# EAGLE design Mini Power Supply (EAGLE 6.4)
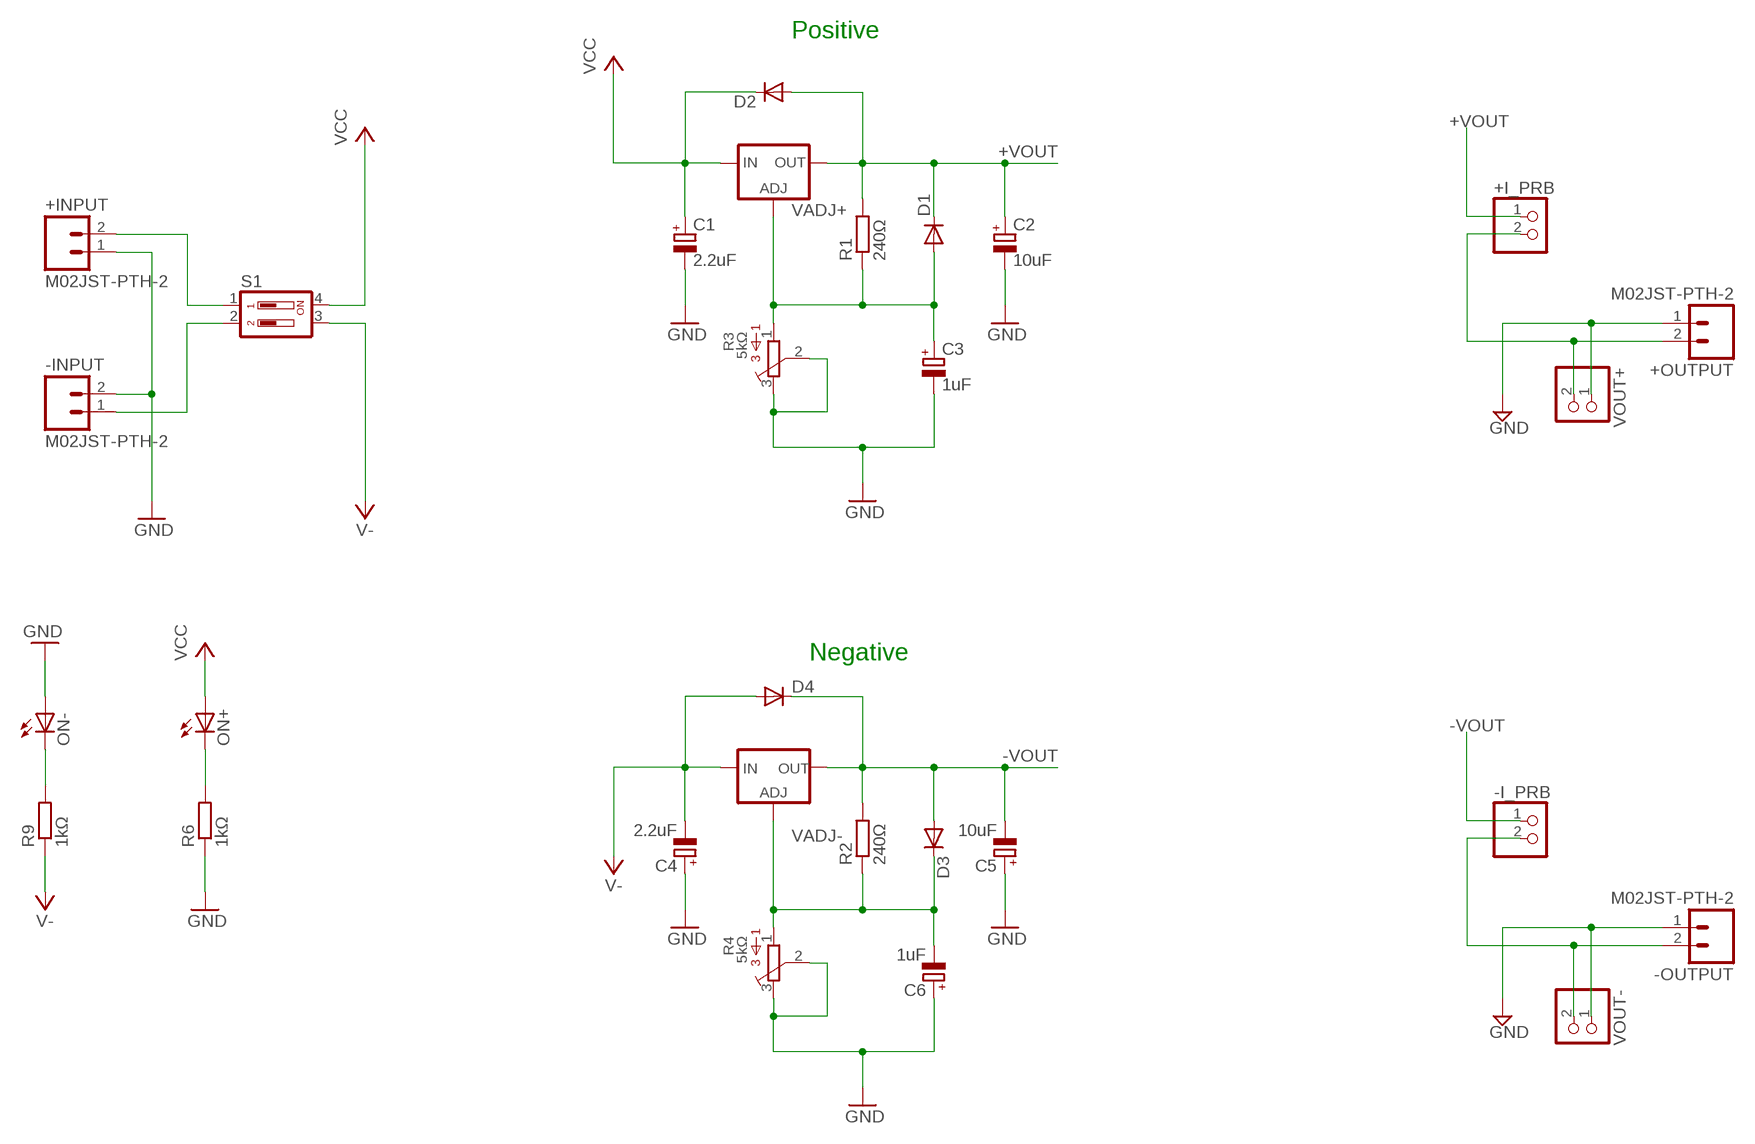
[diagram p0: schematic, sheet 1]

## Parts
+I_PRB  PINHD-1X2  [1X02]
+INPUT  M02JST-PTH-2  [JST-2-PTH]
+OUTPUT  M02JST-PTH-2  [JST-2-PTH]
-I_PRB  PINHD-1X2  [1X02]
-INPUT  M02JST-PTH-2  [JST-2-PTH]
-OUTPUT  M02JST-PTH-2  [JST-2-PTH]
C1  2.2uF  CPOL-EUE2.5-6  [E2,5-6]
C2  10uF  CPOL-EUE2.5-6  [E2,5-6]
C3  1uF  CPOL-EUE2.5-6  [E2,5-6]
C4  2.2uF  CPOL-EUE2.5-6  [E2,5-6]
C5  10uF  CPOL-EUE2.5-6  [E2,5-6]
C6  1uF  CPOL-EUE2.5-6  [E2,5-6]
D1  1N4148DO35-7  [DO35-7]
D2  1N4148DO35-7  [DO35-7]
D3  1N4148DO35-7  [DO35-7]
D4  1N4148DO35-7  [DO35-7]
ON+  LEDSQR2X5  [LED2X5]
ON-  LEDSQR2X5  [LED2X5]
R1  240Ω  R-EU_0207/10  [0207/10]
R2  240Ω  R-EU_0207/10  [0207/10]
R3  5kΩ  3386-U  [3386U]
R4  5kΩ  3386-U  [3386U]
R6  1kΩ  R-EU_0207/10  [0207/10]
R9  1kΩ  R-EU_0207/10  [0207/10]
S1  DIP02YL  [DIP02YL]
VADJ+  LM317L  [317L]
VADJ-  LM337L  [337L]
VOUT+  PINHD-1X2  [1X02]
VOUT-  PINHD-1X2  [1X02]

## Nets
+VOUT: +I_PRB.1 C2.+ D1.C D2.A R1.2 VADJ+.2(OUT)
-VOUT: -I_PRB.1 C5.- D3.A D4.C R2.2 VADJ-.OUT
GND: +INPUT.1 +OUTPUT.1 -INPUT.2 -OUTPUT.1 C1.- C2.- C3.- C4.+ C5.+ C6.+ ON-.A R3.2 R3.3 R4.2 R4.3 R6.1 VOUT+.1 VOUT-.1
N$1: C6.- D3.C R2.1 R4.1 VADJ-.ADJ
N$2: +INPUT.2 S1.1
N$3: C3.+ D1.A R1.1 R3.1 VADJ+.1(ADJ)
N$4: ON-.K(C) R9.2
N$5: -INPUT.1 S1.2
N$6: ON+.K(C) R6.2
N$7: +I_PRB.2 +OUTPUT.2 VOUT+.2
N$10: -I_PRB.2 -OUTPUT.2 VOUT-.2
V-: C4.- D4.A R9.1 S1.3 VADJ-.IN
VCC: C1.+ D2.C ON+.A S1.4 VADJ+.3(IN)

## Notes on the sheet
- Positive
- Negative

## Library data of the parts
+I_PRB -I_PRB VOUT+ VOUT- = pinhead:PINHD-1X2: PIN HEADER
+INPUT +OUTPUT -INPUT -OUTPUT = SparkFun-Connectors:M02: Standard 2-pin 0.1" header. Use with - straight break away headers ( PRT-00116) - right angle break away headers (PRT-00553) - swiss pins (PRT-00743) - machine pins (PRT-00117) - female headers (PRT-00115) Molex polarized connector foot print use with: PRT-08233 with associated crimp pins and housings. 2.54_SCREWTERM for use with PRT-10571. 3.5mm Screw Terminal footprints for PRT-08084 5mm Screw Terminal footprints for use with PRT-08433
C1-C6 = rcl:CPOL-EU: POLARIZED CAPACITOR, European symbol
D1-D4 = diode:1N4148: DIODE high speed (Philips)
ON+ ON- = led:LED: LED OSRAM: - CHIPLED LG R971, LG N971, LY N971, LG Q971, LY Q971, LO R971, LY R971 LH N974, LH R974 LS Q976, LO Q976, LY Q976 LO Q996 - Hyper CHIPLED LW Q18S LB Q993, LB Q99A, LB R99A - SideLED LS A670, LO A670, LY A670, LG A670, LP A670 LB A673, LV A673, LT A673, LW A673 LH A674 LY A675 LS A676, LA A676, LO A676, LY A676, LW A676 LS A679, LY A679, LG A679 - Hyper Micro SIDELED® LS Y876, LA Y876, LO Y876, LY Y876 LT Y87S - SmartLED LW L88C, LW L88S LB L89C, LB L89S, LG L890 LS L89K, LO L89K, LY L89K LS L896, LA L896, LO L896, LY L896 - TOPLED LS T670, LO T670, LY T670, LG T670, LP T670 LSG T670, LSP T670, LSY T670, LOP T670, LYG T670 LG T671, LOG T671, LSG T671 LB T673, LV T673, LT T673, LW T673 LH T674 LS T676, LA T676, LO T676, LY T676, LB T676, LH T676, LSB T676, LW T676 LB T67C, LV T67C, LT T67C, LS T67K, LO T67K, LY T67K, LW E67C LS E67B, LA E67B, LO E67B, LY E67B, LB E67C, LV E67C, LT E67C LW T67C LS T679, LY T679, LG T679 LS T770, LO T770, LY T770, LG T770, LP T770 LB T773, LV T773, LT T773, LW T773 LH T774 LS E675, LA E675, LY E675, LS T675 LS T776, LA T776, LO T776, LY T776, LB T776 LHGB T686 LT T68C, LB T68C - Hyper Mini TOPLED® LB M676 - Mini TOPLED Santana® LG M470 LS M47K, LO M47K, LY M47K Source: http://www.osram.convergy.de LUXEON: - LUMILED® LXK2-PW12-R00, LXK2-PW12-S00, LXK2-PW14-U00, LXK2-PW14-V00 LXK2-PM12-R00, LXK2-PM12-S00, LXK2-PM14-U00 LXK2-PE12-Q00, LXK2-PE12-R00, LXK2-PE12-S00, LXK2-PE14-T00, LXK2-PE14-U00 LXK2-PB12-K00, LXK2-PB12-L00, LXK2-PB12-M00, LXK2-PB14-N00, LXK2-PB14-P00, LXK2-PB14-Q00 LXK2-PR12-L00, LXK2-PR12-M00, LXK2-PR14-Q00, LXK2-PR14-R00 LXK2-PD12-Q00, LXK2-PD12-R00, LXK2-PD12-S00 LXK2-PH12-R00, LXK2-PH12-S00 LXK2-PL12-P00, LXK2-PL12-Q00, LXK2-PL12-R00 Source: www.luxeon.com KINGBRIGHT: KA-3528ASYC Source: www.kingbright.com
R1 R2 R6 R9 = resistor:R-EU_: RESISTOR, European symbol
R3 R4 = bourns:3386-: 3386 Series 3/8" Square Trimmer
S1 = switch-dil:DIP02YL: DIL/CODE SWITCH; OC_FARNELL: unknown; OC_NEWARK: unknown
VADJ+ = v-reg:LM317L: VOLTAGE REGULATOR
VADJ- = v-reg:LM337L: VOLTAGE REGULATOR

## Board
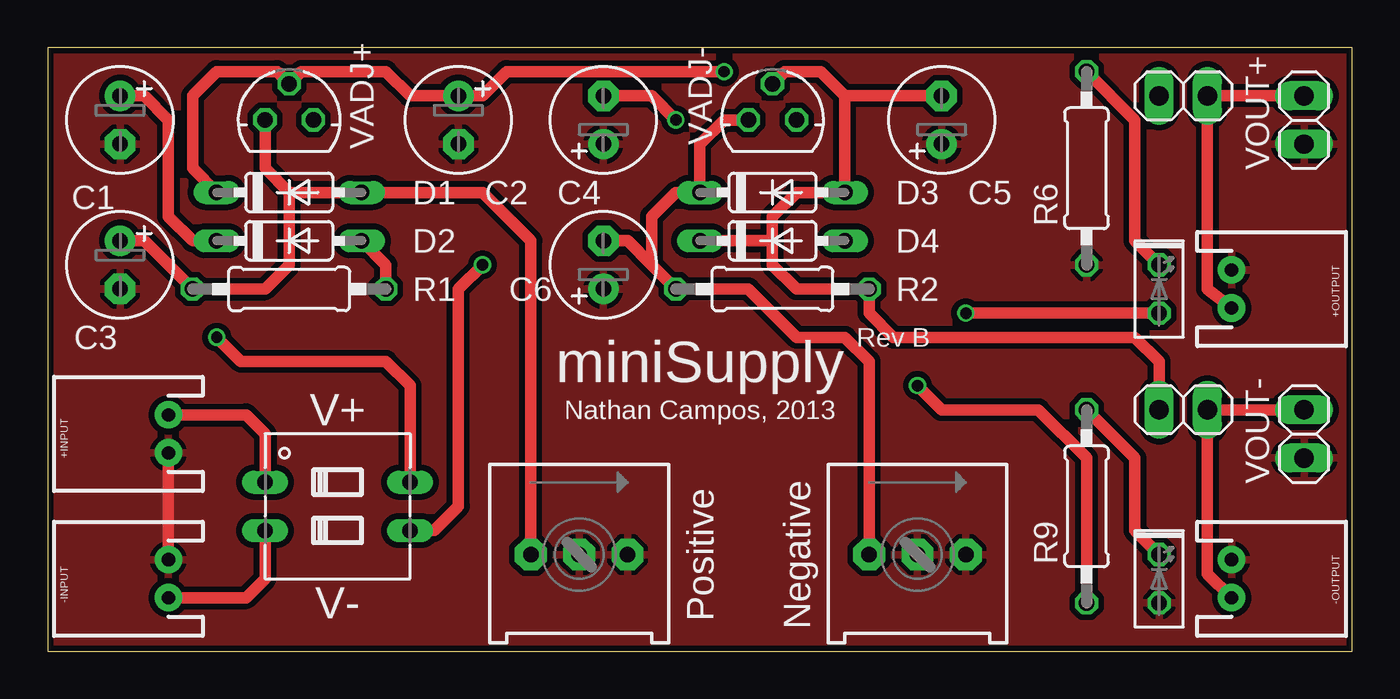
[diagram p1: board, top side]
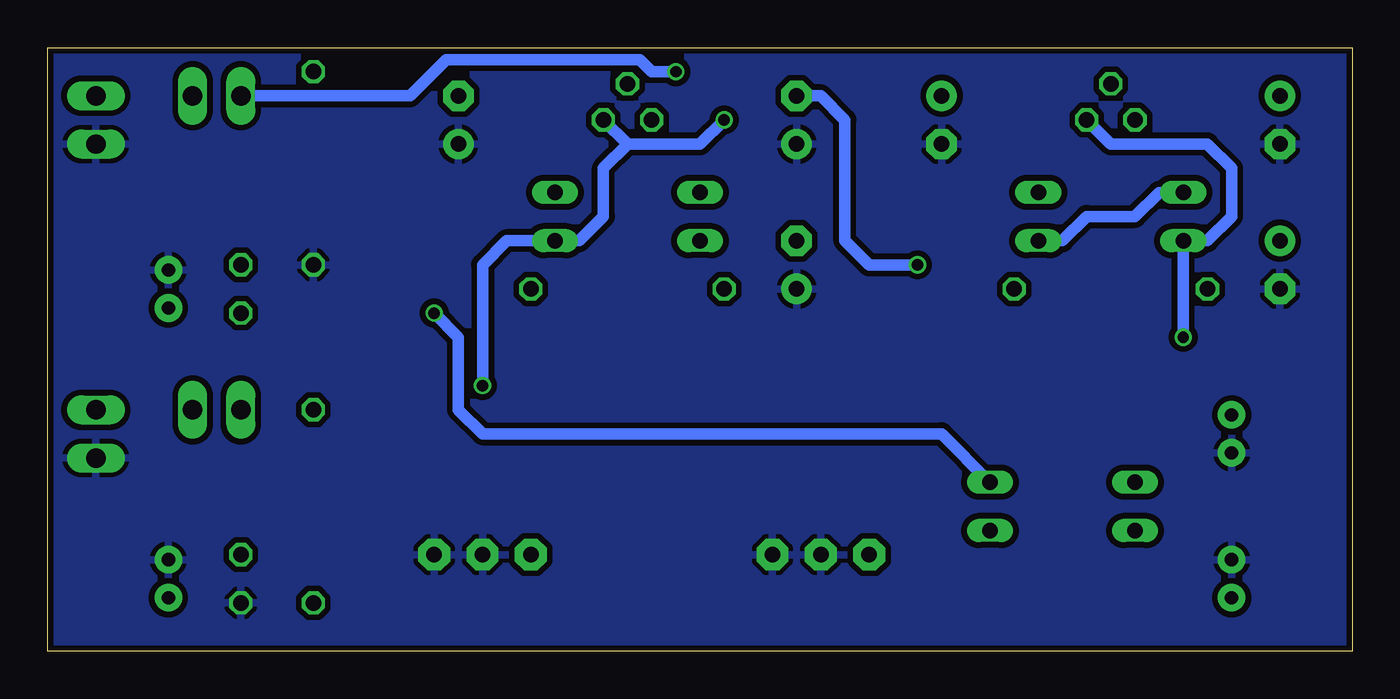
[diagram p2: board, bottom side, seen from below]

Size 68.58 x 31.75 mm. Coordinates in mm from the lower left corner, seen from the top.
Outline: 0,0 68.58,0 68.58,31.75 0,31.75 0,0
Copper layers (1*2*15*16): Top 0.035mm / dielectric 0.2mm / Route2 0.0175mm / dielectric 1.1mm / Route15 0.0175mm / dielectric 0.2mm / Bottom 0.035mm
Design rules "SeeedStudio_DRU_no_angle_20130527": minimum track width 6mil, minimum drill 12mil, track to track 6mil, track to pad 6mil, pad to pad 6mil, via to via 6mil, smd to smd 0mil, copper to edge 10mil, drill to drill 10mil, minimum pad ring 6mil, minimum via ring 6mil, stop-mask expansion 2mil, vias tented up to drill 25mil, thermal gap 10mil

### Footprints (pad centres in the part's own frame; a part is rotated, then mirrored left to right if it is on the bottom)
1X02 = drill 1.016 long: 1 -1.27,0; 2 1.27,0
JST-2-PTH = drill 0.7 pad 1.448: 1 -1,0; 2 1,0
E2,5-6 = drill 0.813 pad 1.6: + -1.27,0 | drill 0.813 pad 1.6 octagon: - 1.27,0
DO35-7 = drill 0.813 long: A 3.81,0; C -3.81,0
LED2X5 = drill 0.813 octagon: A -1.27,0; K 1.27,0
0207/10 = drill 0.813 octagon: 1 -5.08,0; 2 5.08,0
3386U = drill 0.813 pad 1.676 octagon: 1 -2.54,0; 2 0,0; 3 2.54,0
DIP02YL = drill 0.813 long: 1 -1.27,-3.81; 2 1.27,-3.81; 3 1.27,3.81; 4 -1.27,3.81
317L = drill 0.813 octagon: 1 -1.27,0; 2 0,1.905; 3 1.27,0
337L = drill 0.813 octagon: ADJ -1.27,0; IN 1.27,0; OUT 0,1.905

### Placement (x,y rotation side)
+I_PRB  59.69,29.21 0 top
+INPUT  6.35,11.43 90 top
+OUTPUT  62.23,19.05 270 top
-I_PRB  59.69,12.7 0 top
-INPUT  6.35,3.81 90 top
-OUTPUT  62.23,3.81 270 top
C1  3.81,27.94 270 top
C2  21.59,27.94 270 top
C3  3.81,20.32 270 top
C4  29.21,27.94 90 top
C5  46.99,27.94 90 top
C6  29.21,20.32 90 top
D1  12.7,24.13 0 top
D2  12.7,21.59 0 top
D3  38.1,24.13 0 top
D4  38.1,21.59 0 top
ON+  58.42,19.05 90 top
ON-  58.42,3.81 90 top
R1  12.7,19.05 0 top
R2  38.1,19.05 0 top
R3  27.94,5.08 0 top
R4  45.72,5.08 0 top
R6  54.61,25.4 90 top
R9  54.61,7.62 90 top
S1  15.24,7.62 270 top
VADJ+  12.7,27.94 0 top
VADJ-  38.1,27.94 0 top
VOUT+  66.04,27.94 90 top
VOUT-  66.04,11.43 90 top

### Tracks (layer width: path | path; a pad name or v marks a point on that pad's centre or on a via)
+VOUT  (via drill 0.6)
  Top 0.61: D1.C 7.62,25.4 7.62,29.21 8.89,30.48 12.06,30.48 VADJ+.2 13.34,30.48 17.78,30.48 19.05,29.21 C2.+ 22.86,29.21 24.13,30.48 v35.56,30.48 | R1.2 17.78,20.32 D2.A
  Bottom 0.61: D2.A 15.24,21.59 13.97,22.86 11.43,22.86 10.16,24.13 D1.C | +I_PRB.1 49.53,29.21 47.62,31.11 37.47,31.11 36.83,30.48 v35.56,30.48
-VOUT
  Top 0.61: 41.91,29.21 D3.A 39.37,24.13 38.1,22.86 38.1,21.59 | 41.91,29.21 40.64,30.48 38.73,30.48 VADJ-.OUT | 38.1,21.59 38.1,20.32 39.37,19.05 R2.2 43.18,17.78 44.45,16.51 57.15,16.51 58.42,15.24 -I_PRB.1 | D4.C 38.1,21.59 | C5.- 41.91,29.21
GND
  Top 0.61: +INPUT.1 -INPUT.2
  pour Top (isolate 0.305): 0,31.75 68.58,31.75 68.58,0 0,0
  pour Bottom (isolate 0.305): 0,31.75 68.58,31.75 68.58,0 0,0
N$1
  Top 0.61: 31.75,20.32 R2.1 36.83,19.05 39.37,16.51 41.91,16.51 43.18,15.24 R4.1 | 31.75,20.32 31.75,22.86 33.02,24.13 D3.C 34.29,26.67 35.56,27.94 VADJ-.ADJ | C6.- 30.48,21.59 31.75,20.32
N$2
  Top 0.61: +INPUT.2 10.43,12.43 11.43,11.43 S1.1
N$3
  Top 0.61: 12.7,24.13 D1.A 22.86,24.13 25.4,21.59 R3.1 | 12.7,24.13 11.43,25.4 VADJ+.1 | 12.7,24.13 12.7,20.32 11.43,19.05 R1.1 5.08,21.59 C3.+
N$4
  Top 0.61: R9.2 57.15,10.16 57.15,6.35 ON-.K
N$5
  Top 0.61: -INPUT.1 10.43,2.81 11.43,3.81 S1.2
N$6
  Top 0.61: R6.2 57.15,27.94 57.15,21.59 ON+.K
N$7
  Top 0.61: VOUT+.2 +I_PRB.2 60.96,19.05 +OUTPUT.2
N$10
  Top 0.61: VOUT-.2 -I_PRB.2 60.96,4.08 -OUTPUT.2
V-  (via drill 0.6)
  Top 0.61: C4.- 31.75,29.21 v33.02,27.94 | S1.3 20.32,6.35 21.59,7.62 21.59,19.05 v22.86,20.32 | R9.1 54.61,10.16 52.07,12.7 46.99,12.7 v45.72,13.97
  Bottom 0.61: v33.02,27.94 34.29,26.67 38.1,26.67 | v22.86,20.32 25.4,20.32 26.67,21.59 26.67,27.94 27.94,29.21 C4.- | v45.72,13.97 45.72,20.32 44.45,21.59 D4.A 40.64,21.59 39.37,22.86 39.37,25.4 38.1,26.67 | 38.1,26.67 VADJ-.IN
VCC  (via drill 0.6)
  Top 0.61: C1.+ 5.08,29.21 6.35,27.94 6.35,22.86 7.62,21.59 D2.C | S1.4 19.05,13.97 17.78,15.24 10.16,15.24 v8.89,16.51 | ON+.A v48.26,17.78
  Bottom 0.61: VADJ+.3 12.7,26.67 7.62,26.67 6.35,25.4 6.35,22.86 7.62,21.59 D2.C v8.89,16.51 | v48.26,17.78 46.99,16.51 46.99,12.7 45.72,11.43 21.59,11.43 S1.4

### Text on the board
tPlace: Rev B | miniSupply | V+ | Nathan Campos, 2013 | Positive | Negative | V-